# Altium schematic sheet MIXR Power - 48V Phantom Power Supply.SchDoc: Title
size B; Organization: Midnight Sun Solar Rayce Car Team; Address1: University of Waterloo; Address2: 200 University Ave W; Address3: Waterloo, ON, Canada; Address4: N2L 3E9; Website: www.uwmidsun.com; ProjectName: ProjectName
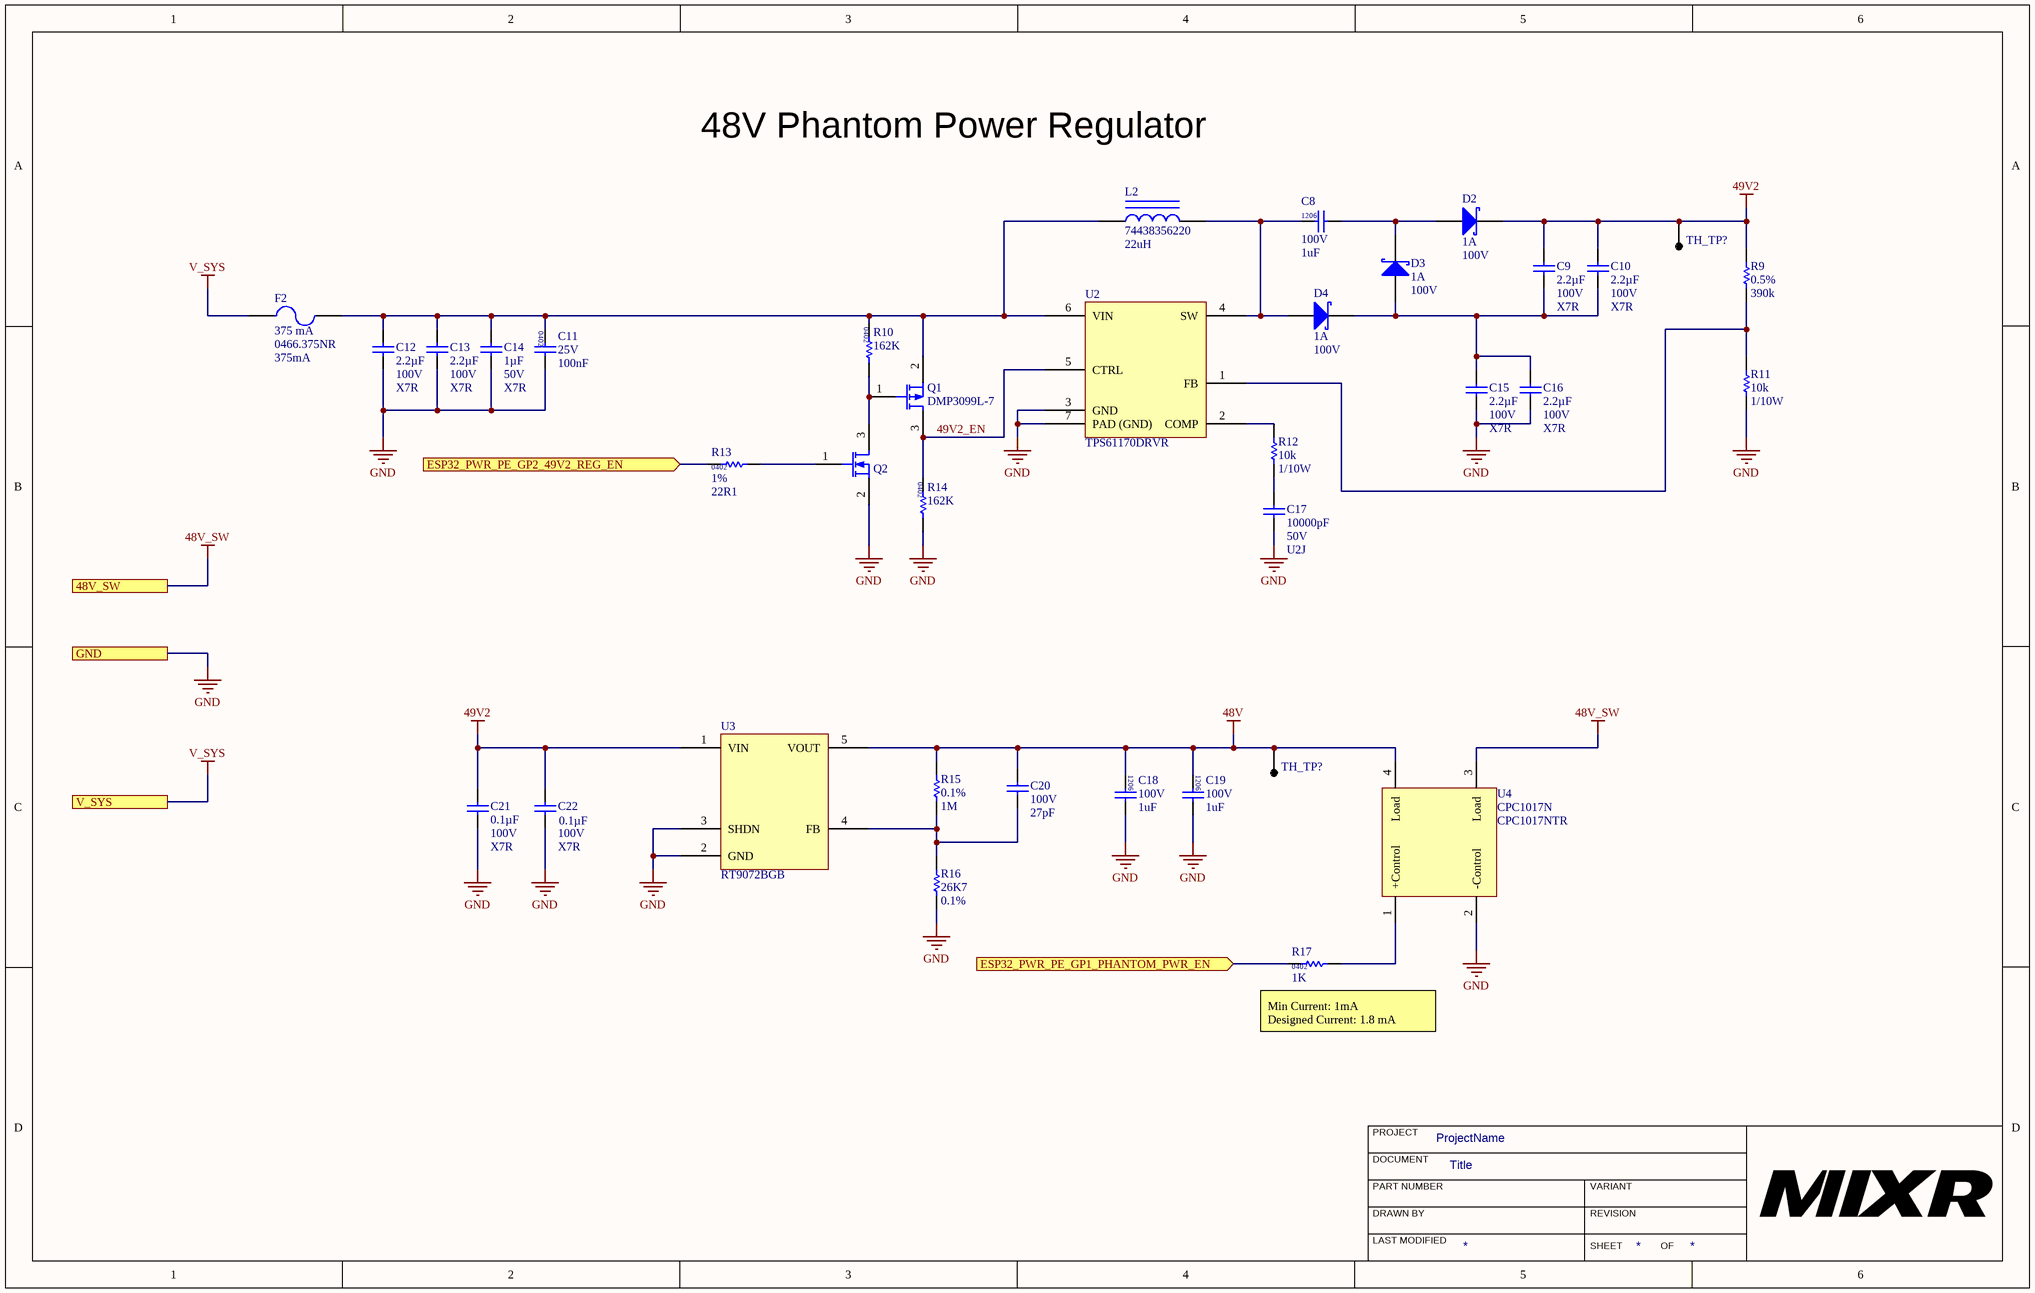
[diagram p0: MIXR Power - 48V Phantom Power Supply.SchDoc]

## Parts
(Parts that share a designator on the sheet are numbered #1, #2 ... from top to bottom, then left to right.)
C8  Voltage Rating: 100V  Capacitance: 1uF  [CAP, 1206]  (hidden comment: CAP CER 1UF 100V X7R 1206)
C9  Capacitance: 2.2µF  Voltage: 100V  Temperature Coefficient: X7R  [CAP, 1206]  (hidden comment: CAP CER 2.2UF 100V ±20% X7R 1206)
C10  Capacitance: 2.2µF  Voltage: 100V  Temperature Coefficient: X7R  [CAP, 1206]  (hidden comment: CAP CER 2.2UF 100V ±20% X7R 1206)
C11  Voltage: 25V  Capacitance: 100nF  [CAP 0402]  (hidden comment: CAP CER 0.1UF 16V X7R 0402)
C12  Capacitance: 2.2µF  Voltage: 100V  Temperature Coefficient: X7R  [CAP, 1206]  (hidden comment: CAP CER 2.2UF 100V ±20% X7R 1206)
C13  Capacitance: 2.2µF  Voltage: 100V  Temperature Coefficient: X7R  [CAP, 1206]  (hidden comment: CAP CER 2.2UF 100V ±20% X7R 1206)
C14  Capacitance: 1µF  Voltage: 50V  Temperature Coefficient: X7R  [CAP, 0603]  (hidden comment: CAP CER 1UF 50V 10% X7R 0603)
C15  Capacitance: 2.2µF  Voltage: 100V  Temperature Coefficient: X7R  [CAP, 1206]  (hidden comment: CAP CER 2.2UF 100V ±20% X7R 1206)
C16  Capacitance: 2.2µF  Voltage: 100V  Temperature Coefficient: X7R  [CAP, 1206]  (hidden comment: CAP CER 2.2UF 100V ±20% X7R 1206)
C17  Capacitance: 10000pF  Voltage: 50V  Temperature Coefficient: U2J  [CAP, 0603]  (hidden comment: CAP CER 10nF 50V 5% X7R 0603)
C18  Voltage Rating: 100V  Capacitance: 1uF  [CAP, 1206]  (hidden comment: CAP CER 1UF 100V X7R 1206)
C19  Voltage Rating: 100V  Capacitance: 1uF  [CAP, 1206]  (hidden comment: CAP CER 1UF 100V X7R 1206)
C20  Voltage Rating: 100V  Capacitance: 27pF  [CAP, 0603]  (hidden comment: CAP CER 27PF 100V 5% C0G/NP0 0603)
C21  Capacitance: 0.1µF  Voltage: 100V  Temperature Coefficient: X7R  [CAP, 0805]  (hidden comment: CAP CER 0.1UF 100V 10% X7R 0805)
C22  Capacitance: 0.1µF  Voltage: 100V  Temperature Coefficient: X7R  [CAP, 0805]  (hidden comment: CAP CER 0.1UF 100V 10% X7R 0805)
D2  Average Rectified Current: 1A  Max Reverse Voltage (DC): 100V  [DIODE SOD123]  (hidden comment: DIODE SCHOTTKY 100V 1A SOD123FL)
D3  Average Rectified Current: 1A  Max Reverse Voltage (DC): 100V  [DIODE SOD123]  (hidden comment: DIODE SCHOTTKY 100V 1A SOD123FL)
D4  Average Rectified Current: 1A  Max Reverse Voltage (DC): 100V  [DIODE SOD123]  (hidden comment: DIODE SCHOTTKY 100V 1A SOD123FL)
F2  375 mA  Manufacturer Part Number: 0466.375NR  Current Rating: 375mA  [FUSE LITTLEFUSE 0466 1206]
L2  Manufacturer Part Number: 74438356220  Inductance: 22uH  [IND 22UH 1.7A 280MOHM SMD]  (hidden comment: IND 22UH 1.7A 280 MOHM SMD)
Q1  Manufacturer Part Number: DMP3099L-7  [MOSFET P-CH 30V 3.8A SOT-23]  (hidden comment: MOSFET P-CH 30V 3.8A SOT-23)
Q2  MOSFET N-CH 30V 6.2A 0.9W SOT-23  [MOSFET N-CH 30V 6.2A 0.9W SOT-23]  (value not drawn)
R9  Tolerance: 0.5%  Resistance: 390k  [RES, 0603]  (hidden comment: RES 390K OHM 1% 1/10W 0603)
R10  Resistance: 162K  [RES 0402]  (hidden comment: RES 162K OHM 1% 1/16W 0402)
R11  Resistance: 10k  Power: 1/10W  [RES, 0603]  (hidden comment: RES 10K OHM 1% 1/10W 0603)
R12  Resistance: 10k  Power: 1/10W  [RES, 0603]  (hidden comment: RES 10K OHM 1% 1/10W 0603)
R13  Tolerance: 1%  Resistance: 22R1  [RES 0402]  (hidden comment: RES 22.1 OHM 1% 1/16W 0402)
R14  Resistance: 162K  [RES 0402]  (hidden comment: RES 162K OHM 1% 1/16W 0402)
R15  Tolerance: 0.1%  Resistance: 1M  [RES, 0603]  (hidden comment: RES 1M OHM 0.1% 1/10W 0603)
R16  Resistance: 26K7  Tolerance: 0.1%  [RES, 0603]  (hidden comment: RES 26.7K OHM 0.1% 1/10W 0603)
R17  Resistance: 1K  [RES 0402]  (hidden comment: RES 1K OHM 0.1% 1/16W 0402)
TH_TP?#1  Thru Test Point  [Thru Test Point]  (value not drawn)
TH_TP?#2  Thru Test Point  [Thru Test Point]  (value not drawn)
U2  Manufacturer Part Number: TPS61170DRVR  [QFN65P200X200X80_HS-7M]  (hidden comment: IC REG BOOST 38V 1.2A 6-WDFN)
U3  Manufacturer Part Number: RT9072BGB  [SOT95P280X145-5N]  (hidden comment: IC REG LDO 80V ADJ 20MA SOT23-5)
U4  CPC1017N  Manufacturer Part Number: CPC1017NTR  [RELAY SOP4]

## Ports
48V_SW, ESP32_PWR_PE_GP1_PHANTOM_PWR_EN (in), ESP32_PWR_PE_GP2_49V2_REG_EN (in), GND, V_SYS

## Nets
48V: C18.1 C19.1 C20.1 R15.1 TH_TP?#2.TH_TP U3.5(VOUT) U4.4(Load)
48V_SW: U4.3(Load) ; port 48V_SW
49V2: C9.1 C10.1 C21.1 C22.1 D2.1 R9.1 TH_TP?#1.TH_TP U3.1(VIN)
GND: C11.2 C12.2 C13.2 C14.2 C15.2 C16.2 C17.2 C18.2 C19.2 C21.2 C22.2 Q2.2(S) R11.2 R14.2 R16.2 U2.3(GND) U2.7(PAD_(GND)) U3.2(GND) U3.3(SHDN) U4.2(-Control) ; port GND
V_SYS: F2.1 ; port V_SYS
49V2_EN: Q1.3(D) R14.1 U2.5(CTRL)
ESP32_PWR_PE_GP1_PHANTOM_PWR_EN: R17.1 ; port ESP32_PWR_PE_GP1_PHANTOM_PWR_EN
ESP32_PWR_PE_GP2_49V2_REG_EN: R13.1 ; port ESP32_PWR_PE_GP2_49V2_REG_EN
NetC8_1: C8.1 D4.2 L2.2 U2.4(SW)
NetC8_2: C8.2 D2.2 D3.1
NetC9_2: C9.2 C10.2 C15.1 C16.1 D3.2 D4.1
NetC11_1: C11.1 C12.1 C13.1 C14.1 F2.2 L2.1 Q1.2(S) R10.1 U2.6(VIN)
NetC17_1: C17.1 R12.2
NetC20_2: C20.2 R15.2 R16.1 U3.4(FB)
NetQ1_1: Q1.1(G) Q2.3(D) R10.2
NetQ2_1: Q2.1(G) R13.2
NetR9_2: R9.2 R11.1 U2.1(FB)
NetR12_1: R12.1 U2.2(COMP)
NetR17_2: R17.2 U4.1(+Control)

## Notes on the sheet
- 48V Phantom Power Regulator
- (near R17) Min Current: 1mA
  Designed Current: 1.8 mA
- PROJECT
- DOCUMENT
- DRAWN BY
- LAST MODIFIED
- PART NUMBER
- REVISION
- SHEET
- VARIANT
- OF

## Library data of the parts
C8 C18 C19 = CAP CER 1UF 100V X7R 1206: Cap Ceramic 1uF 100V X7R 10% SMD 1206 125C Embossed T/R; Manufacturer: Samsung; Manufacturer Part Number: CL31B105KCHNNNE; Supplier 1: Digi-Key; RoHS: Yes; Category: Ceramic Capacitors; Stock 1: 981184; Pricing 1: 1=0.32000, 10=0.22100, 100=0.13260, 500=0.09942, 1000=0.08396 (USD); Mount: Surface Mount; Case Code (Metric): 3216; Case Code (Imperial): 1206; Contact Plating: Tin; Min Operating Temperature: -55°C; Max Operating Temperature: 125°C; Packaging: Tape and Reel; Tolerance: 10%; Dielectric: X7R; Length: 3.2mm; Height: 1.6mm; Width: 0.063inch; Thickness: 0.071inch; Depth: 1.6mm; Radiation Hardening: No; ComponentLink1URL: https://datasheet.ciiva.com/25711/cl31b105kchnnne-25711248.pdf?src-supplier=Digi-Key; ComponentLink1Description: https://datasheet.ciiva.com/25711/cl31b105kchnnne-25711248.pdf?src-supplier=Digi-Key; ComponentLink2URL: https://datasheet.ciiva.com/16437/clseries-16437207.pdf?src-supplier=Future+Electronics; ComponentLink2Description: https://datasheet.ciiva.com/16437/clseries-16437207.pdf?src-supplier=Future+Electronics; Case/Package: 1206; Supplier Part Number 1: 1276-1838-1-ND
C9 C10 C12 C13 C15 C16 = CAP CER 2.2UF 100V ±20% X7R 1206: 2.2µF ±20% 100V Ceramic Capacitor X7R 1206 (3216 Metric); Manufacturer 1: Murata Electronics North America; Manufacturer Part Number 1: GRM31CR72A225MA73L; Supplier 1: Digi-Key; Supplier Part Number 1: 490-12773-1-ND; Packaging: Cut Tape (CT); Part Status: Active; Operating Temperature: -55°C ~ 125°C; Ratings: -; Mounting Type: Surface Mount, MLCC; Package / Case: 1206 (3216 Metric); Size / Dimension: 0.126" L x 0.063" W (3.20mm x 1.60mm); Height - Seated (Max): -; Thickness (Max): 0.071" (1.80mm); Lead Spacing: -; Lead Style: -; ComponentLink1URL: http://www.murata.com/~/media/webrenewal/support/library/catalog/products/capacitor/mlcc/c02e.ashx; ComponentLink1Description: http://www.murata.com/~/media/webrenewal/support/library/catalog/products/capacitor/mlcc/c02e.ashx; Tolerance: ±20%
C11 = CAP CER 0.1UF 16V X7R 0402: Cap Ceramic 0.1uF 25V X7R 10% SMD 0402 125C Paper T/R; Manufacturer: Murata; Manufacturer Part Number: GRM155R71E104KE14D; Supplier 1: Digi-Key; RoHS: Yes; Category: Ceramic Capacitors; Stock 1: 785540; Pricing 1: 1=0.10000, 10=0.03400, 100=0.01520, 500=0.01088, 1000=0.00855, 2500=0.00778, 5000=0.00715 (USD); Mount: Surface Mount; Case/Package: 0402; Weight: 0.000212oz; Case Code (Metric): 1005; Case Code (Imperial): 0402; Dielectric Material: Ceramic; Min Operating Temperature: -55°C; Max Operating Temperature: 125°C; Packaging: Tape and Reel; Tolerance: 10%; Termination: SMD/SMT; Composition: Ceramic; Package Quantity: 10000; Length: 1mm; Height: 0.5mm; Width: 0.02inch; Thickness: 0.022inch; Depth: 0.5mm; REACH SVHC: Unknown; Lead Free: Lead Free; ComponentLink1URL: http://www.farnell.com/datasheets/2048008.pdf?src-supplier=Farnell; ComponentLink1Description: http://www.farnell.com/datasheets/2048008.pdf?src-supplier=Farnell; ComponentLink2URL: http://uk.rs-online.com/webdocs/144c/0900766b8144c113.pdf?src-supplier=RSComponents; ComponentLink2Description: http://uk.rs-online.com/webdocs/144c/0900766b8144c113.pdf?src-supplier=RSComponents; ComponentLink3URL: http://www.farnell.com/datasheets/1872206.pdf?src-supplier=Farnell; ComponentLink3Description: http://www.farnell.com/datasheets/1872206.pdf?src-supplier=Farnell; ComponentLink4URL: http://components.arrow.com/part/dataview/0323_06361249?src-supplier=Arrow+Europe; ComponentLink4Description: http://components.arrow.com/part/dataview/0323_06361249?src-supplier=Arrow+Europe; ComponentLink5URL: http://www.mouser.com/ds/2/281/c02e-2905.pdf?src-supplier=Mouser; ComponentLink5Description: http://www.mouser.com/ds/2/281/c02e-2905.pdf?src-supplier=Mouser; ComponentLink6URL: http://www.farnell.com/datasheets/2048008.pdf?src-supplier=Newark; ComponentLink6Description: http://www.farnell.com/datasheets/2048008.pdf?src-supplier=Newark; ComponentLink7URL: http://psearch.en.murata.com/capacitor/product/GRM155R71E104KE14%23.pdf?src-supplier=Avnet; ComponentLink7Description: http://psearch.en.murata.com/capacitor/product/GRM155R71E104KE14%23.pdf?src-supplier=Avnet; ComponentLink8URL: https://search.murata.co.jp/Ceramy/image/img/A01X/G101/ENG/GRM155R71E104KE14-01.pdf?src-supplier=Digi-Key; ComponentLink8Description: https://search.murata.co.jp/Ceramy/image/img/A01X/G101/ENG/GRM155R71E104KE14-01.pdf?src-supplier=Digi-Key; ComponentLink9URL: http://www.farnell.com/datasheets/2048008.pdf?src-supplier=Element14; ComponentLink9Description: http://www.farnell.com/datasheets/2048008.pdf?src-supplier=Element14; Supplier Part Number 1: 490-10698-1-ND; Dielectric: X7R; Voltage Rating (DC): 25V; Voltage Rating: 25V
C14 = CAP CER 1UF 50V 10% X7R 0603: 1µF ±10% 50V Ceramic Capacitor X7R 0603 (1608 Metric); Manufacturer 1: Taiyo Yuden; Manufacturer Part Number 1: UMK107AB7105KA-T; Supplier 1: Digi-Key; Supplier Part Number 1: 587-3247-1-ND; Packaging: Cut Tape (CT); Part Status: Active; Operating Temperature: -55°C ~ 125°C; Ratings: -; Mounting Type: Surface Mount, MLCC; Package / Case: 0603 (1608 Metric); Size / Dimension: 0.063" L x 0.031" W (1.60mm x 0.80mm); Height - Seated (Max): -; Thickness (Max): 0.037" (0.95mm); Lead Spacing: -; Lead Style: -; ComponentLink1URL: http://www.yuden.co.jp/productdata/catalog/en/mlcc_all_e.pdf; ComponentLink1Description: http://www.yuden.co.jp/productdata/catalog/en/mlcc_all_e.pdf; Tolerance: ±10%
C17 = CAP CER 10nF 50V 5% X7R 0603: 10000pF ±5% 50V Ceramic Capacitor U2J 0603 (1608 Metric); Manufacturer 1: KEMET; Manufacturer Part Number 1: C0603C103J5JAC7867; Supplier 1: Digi-Key; Supplier Part Number 1: 399-13384-1-ND; Packaging: Cut Tape (CT); Part Status: Active; Operating Temperature: -55°C ~ 125°C; Ratings: -; Failure Rate: -; Mounting Type: Surface Mount, MLCC; Package / Case: 0603 (1608 Metric); Size / Dimension: 0.063" L x 0.032" W (1.60mm x 0.80mm); Height - Seated (Max): -; Thickness (Max): 0.034" (0.87mm); Lead Spacing: -; Lead Style: -; ComponentLink1URL: http://www.kemet.com/docfinder?Partnumber=C0603C103J5JAC7867; ComponentLink1Description: http://www.kemet.com/docfinder?Partnumber=C0603C103J5JAC7867; Tolerance: ±5%
C20 = CAP CER 27PF 100V 5% C0G/NP0 0603: Cap Ceramic 27pF 100V C0G 5% SMD 0603 125C Paper T/R; Manufacturer: Yageo; Manufacturer Part Number: CC0603JRNPO0BN270; Insulation Resistance: 10GR; Supplier 1: Digi-Key; RoHS: Yes; Category: Ceramic Capacitors; Stock 1: 38025; Pricing 1: 1=0.10000, 10=0.06400, 100=0.02870, 500=0.02048, 1000=0.01609 (USD); Mount: Surface Mount; Case/Package: 0603; Weight: 7.1E-05oz; Case Code (Imperial): 0603; Case Code (Metric): 1608; Min Operating Temperature: -55°C; Max Operating Temperature: 125°C; Packaging: Tape and Reel; Tolerance: 5%; Voltage Rating (DC): 100V; Termination: SMD/SMT; Composition: Ceramic; Length: 0.063inch; Width: 0.031inch; Thickness: 0.035inch; Depth: 0.8mm; Lead Free: Lead Free; ComponentLink1URL: http://www.mouser.com/ds/2/447/Yageo_UPY-GP_NP0_16V-to-50V_9-358835.pdf?src-supplier=Mouser; ComponentLink1Description: http://www.mouser.com/ds/2/447/Yageo_UPY-GP_NP0_16V-to-50V_9-358835.pdf?src-supplier=Mouser; ComponentLink2URL: http://components.arrow.com/part/dataview/0323_00784682?src-supplier=Arrow+Europe; ComponentLink2Description: http://components.arrow.com/part/dataview/0323_00784682?src-supplier=Arrow+Europe; ComponentLink3URL: http://www.yageo.com/documents/recent/UPY-NP0X7R_MV_100-to-630V_21.pdf?src-supplier=Digi-Key; ComponentLink3Description: http://www.yageo.com/documents/recent/UPY-NP0X7R_MV_100-to-630V_21.pdf?src-supplier=Digi-Key; ComponentLink4URL: http://www.yageo.com/documents/recent/UPY-GP_NP0_16V-to-50V_16.pdf?src-supplier=Future+Electronics; ComponentLink4Description: http://www.yageo.com/documents/recent/UPY-GP_NP0_16V-to-50V_16.pdf?src-supplier=Future+Electronics; Dielectric: C0G; Supplier Part Number 1: 311-1757-1-ND
C21 C22 = CAP CER 0.1UF 100V 10% X7R 0805: 0.1µF ±10% 100V Ceramic Capacitor X7R 0805 (2012 Metric); Manufacturer 1: Murata Electronics North America; Manufacturer Part Number 1: GCM21BR72A104KA37L; Supplier 1: Digi-Key; Supplier Part Number 1: 490-4789-1-ND; Packaging: Cut Tape (CT); Part Status: Active; Operating Temperature: -55°C ~ 125°C; Ratings: AEC-Q200; Mounting Type: Surface Mount, MLCC; Package / Case: 0805 (2012 Metric); Size / Dimension: 0.079" L x 0.049" W (2.00mm x 1.25mm); Height - Seated (Max): -; Thickness (Max): 0.055" (1.40mm); Lead Spacing: -; Lead Style: -; ComponentLink1URL: http://www.murata.com/~/media/webrenewal/support/library/catalog/products/capacitor/mlcc/c03e.ashx; ComponentLink1Description: http://www.murata.com/~/media/webrenewal/support/library/catalog/products/capacitor/mlcc/c03e.ashx; Tolerance: ±10%
D2-D4 = DIODE SCHOTTKY 100V 1A SOD123FL: Manufacturer: MCC; Manufacturer Part Number: SL110PL-TP; Supplier 1: Digi-Key; RoHS: Yes; Category: Rectifier Diodes; Stock 1: 10587; Pricing 1: 1=0.33000, 10=0.24700, 100=0.11740, 500=0.09580, 1000=0.07107 (USD); Mount: Surface Mount; Packaging: Tape and Reel; ComponentLink1URL: http://www.mccsemi.com/up_pdf/SL14PL-SL110PL(SOD-123FL)-A.pdf?src-supplier=Digi-Key; ComponentLink1Description: http://www.mccsemi.com/up_pdf/SL14PL-SL110PL(SOD-123FL)-A.pdf?src-supplier=Digi-Key; Supplier Part Number 1: SL110PL-TPMSCT-ND
F2 = FUSE 375MA 125VDC 1206: FUSE BOARD MNT 375MA 125VAC/VDC; Manufacturer: Littelfuse; Body Material: Thermoplastic; Voltage Rating (DC): 125V; Resistance: 690mR; DC Cold Resistance: 350mR; Fuse Type: Board Mount (Cartridge Style Excluded); Approvals: CSA,UL; Supplier 1: Digi-Key; Stock 1: 22359; Pricing 1: 1=0.84, 5=0.812, 10=0.787, 50=0.6618, 100=0.5493, 250=0.4994, 500=0.4245, 1000=0.37455 (USD); Mount: Surface Mount; Case/Package: 1206; Number of Pins: 2; Case Code (Metric): 3216; Case Code (Imperial): 1206; Housing Material: Ceramic; Terminal Material: Copper; Min Operating Temperature: -55°C; Max Operating Temperature: 90°C; Packaging: Tape and Reel; Package Quantity: 5000; Voltage Rating: 125V; Termination: SMD/SMT; Voltage Rating (AC): 125V; Fuse Current: 375mA; Working Voltage: 125V; Length: 3.18mm; Height: 0.023inch; Width: 0.06inch; Depth: 1.52mm; Radiation Hardening: No; REACH SVHC: Unknown; Lead Free: Lead Free; ComponentLink1URL: http://www.littelfuse.com/data/en/Data_Sheets/Littelfuse_Fuse_466.pdf; ComponentLink1Description: http://www.littelfuse.com/data/en/Data_Sheets/Littelfuse_Fuse_466.pdf; ComponentLink2URL: http://www.littelfuse.com/~/media/electronics/datasheets/fuses/littelfuse_fuse_466_datasheet.pdf.pdf; ComponentLink2Description: http://www.littelfuse.com/~/media/electronics/datasheets/fuses/littelfuse_fuse_466_datasheet.pdf.pdf; ComponentLink3URL: //media.digikey.com/pdf/Data%20Sheets/Littelfuse%20PDFs/466%20Series%20Drawing.pdf; ComponentLink3Description: //media.digikey.com/pdf/Data%20Sheets/Littelfuse%20PDFs/466%20Series%20Drawing.pdf; ComponentLink4URL: http://www.farnell.com/datasheets/48294.pdf; ComponentLink4Description: http://www.farnell.com/datasheets/48294.pdf; ComponentLink5URL: https://www.verical.com/server-webapp/html/getDatasheet?partID=134212; ComponentLink5Description: https://www.verical.com/server-webapp/html/getDatasheet?partID=134212; Supplier Part Number 1: F1453CT-ND
L2 = IND 22UH 1.7A 280 MOHM SMD: FIXED IND 22UH 1.7A 280MOHM SMD; Manufacturer: Wurth Electronics; Supplier 1: Digi-Key; RoHS: No; Stock 1: 1274; Pricing 1: 1=1.99000, 50=1.89700, 100=1.75600, 250=1.62600, 500=1.50600 (USD); ComponentLink1URL: https://katalog.we-online.de/pbs/datasheet/74438356220.pdf?src-supplier=Digi-Key; ComponentLink1Description: https://katalog.we-online.de/pbs/datasheet/74438356220.pdf?src-supplier=Digi-Key; Supplier Part Number 1: 732-11664-1-ND
Q1 = MOSFET P-CH 30V 3.8A SOT-23: P-Channel 30V 3.8A (Ta) 1.08W (Ta) Surface Mount SOT-23; Manufacturer: Diodes Incorporated; Drive Voltage (Max Rds On,  Min Rds On): 4.5V, 10V; Rds On (Max) @ Id, Vgs: 65 mOhm @ 3.8A, 10V; Vgs(th) (Max) @ Id: 2.1V @ 250µA; Vgs (Max): ±20V; Supplier 1: Digi-Key; RoHS: RoHS Compliant; Category: Discrete Semiconductor Products; Stock 1: 108364; Pricing 1: 1=0.59, 10=0.429, 100=0.2522, 500=0.14282, 1000=0.10949 (CAD); Packaging: Cut Tape (CT); Part Status: Active; FET Type: P-Channel; Technology: MOSFET (Metal Oxide); Current - Continuous Drain (Id) @ 25°C: 3.8A (Ta); FET Feature: -; Power Dissipation (Max): 1.08W (Ta); Operating Temperature: -55°C ~ 150°C (TJ); Mounting Type: Surface Mount; Supplier Device Package: SOT-23; Package / Case: TO-236-3, SC-59, SOT-23-3; ComponentLink1URL: https://www.diodes.com/assets/Datasheets/DMP3099L.pdf; ComponentLink1Description: https://www.diodes.com/assets/Datasheets/DMP3099L.pdf; Supplier Part Number 1: DMP3099L-7DICT-ND
Q2 = MOSFET N-CH 30V 6.2A 0.9W SOT-23: N-Channel 30V 6.2A (Ta) 900mW (Ta) Surface Mount SOT-23; Manufacturer: Diodes; Manufacturer Part Number: DMN3023L-7; Rds On Max: 25mR; Input Capacitance: 873pF; Supplier 1: Digi-Key; Stock 1: 38246; Pricing 1: 1=0.47, 10=0.368, 100=0.2529, 500=0.1734, 1000=0.1301 (USD); Mount: Surface Mount; Case/Package: TO-236-3; Min Operating Temperature: -55°C; Max Operating Temperature: 150°C; Packaging: Tape and Reel; Drain to Source Voltage (Vdss): 30V; Continuous Drain Current (ID): 6.2A; Max Power Dissipation: 900mW; ComponentLink1URL: https://www.diodes.com/assets/Datasheets/DMN3023L.pdf; ComponentLink1Description: https://www.diodes.com/assets/Datasheets/DMN3023L.pdf; ComponentLink2URL: http://www.mouser.com/ds/2/115/DMN3023L-959533.pdf; ComponentLink2Description: http://www.mouser.com/ds/2/115/DMN3023L-959533.pdf; Supplier Part Number 1: DMN3023L-7DICT-ND
R9 = RES 390K OHM 1% 1/10W 0603: 390 kOhms ±0.5% 0.1W, 1/10W Chip Resistor 0603 (1608 Metric) Thin Film /; Manufacturer: Yageo; Manufacturer Part Number: RT0603DRE07390KL; Max Power Dissipation: 100mW; Temperature Coefficient: 50ppm/°C; Supplier 1: Digi-Key; Supplier Part Number 1: 311-2555-1-ND; Stock 1: 4470; Pricing 1: 1 = 0.13000, 10 = 0.11900, 100 = 0.04580, 1000 = 0.02014, 2500 = 0.01740 (USD); RoHS: Yes; Case/Package: 0603; Case Code (Metric): 1608; Case Code (Imperial): 0603; Min Operating Temperature: -55°C; Max Operating Temperature: 155°C; Packaging: Tape and Reel; Composition: Thin Film; Number of Terminations: 2; Features: Moisture Resistant; Length: 0.063inch; Height: 0.022inch; Width: 0.031inch; ComponentLink1URL: http://www.yageo.com/documents/recent/PYu-RT_1-to-0.01_RoHS_L_9.pdf?src-supplier=Digi-Key; ComponentLink1Description: http://www.yageo.com/documents/recent/PYu-RT_1-to-0.01_RoHS_L_9.pdf?src-supplier=Digi-Key
R10 R14 = RES 162K OHM 1% 1/16W 0402: RES SMD 162K OHM 1% 1/16W 0402; Manufacturer: Yageo; Manufacturer Part Number: RC0402FR-07162KL; Temperature Coefficient: 100ppm/°C; Voltage Rating: 50V; Power Rating: 62.5mW; Max Power Dissipation: 63mW; Supplier 1: Digi-Key; Supplier Part Number 1: YAG2370CT-ND; Packaging: Tape and Reel; Composition: Thick Film; ComponentLink1URL: https://datasheet.ciiva.com/2452/pyu-r-int-thick-7-2452605.pdf?src-supplier=Digi-Key; ComponentLink1Description: https://datasheet.ciiva.com/2452/pyu-r-int-thick-7-2452605.pdf?src-supplier=Digi-Key; Tolerance: 1%; RoHS: Yes; Category: Chip SMD Resistors; Stock 1: 987661; Pricing 1: 1=0.10000, 10=0.01600, 100=0.00640, 1000=0.00289, 2500=0.00251, 5000=0.00207 (USD); Case/Package: 0402; Case Code (Imperial): 0402; Case Code (Metric): 1005; Min Operating Temperature: -55°C; Max Operating Temperature: 155°C; Voltage Rating (DC): 50V; Termination: SMD/SMT; Military Standard: Not; Number of Terminations: 2; Length: 1mm; Height: 0.016inch; Width: 0.02inch; Depth: 0.5mm; Lead Free: Lead Free; ComponentLink2URL: https://datasheet.ciiva.com/16869/pyu-rc0402-51-rohs-l-6-16869191.pdf?src-supplier=Avnet+Europe; ComponentLink2Description: https://datasheet.ciiva.com/16869/pyu-rc0402-51-rohs-l-6-16869191.pdf?src-supplier=Avnet+Europe; Contact Plating: Tin,Matte; Package Quantity: 10000; Features: Moisture Resistant
R11 R12 = RES 10K OHM 1% 1/10W 0603: RES SMD 10K OHM 1% 1/10W 0603; Manufacturer 1: Yageo; Manufacturer Part Number 1: RC0603FR-0710KL; Temperature Coefficient: ±100ppm/°C; Supplier 1: Digi-Key; Supplier Part Number 1: 311-10.0KHRCT-ND; Packaging: Cut Tape (CT); Part Status: Active; Composition: Thick Film; Operating Temperature: -55°C ~ 155°C; Package / Case: 0603 (1608 Metric); Supplier Device Package: 0603; Size / Dimension: 0.063" L x 0.031" W (1.60mm x 0.80mm); Height - Seated (Max): 0.022" (0.55mm); Failure Rate: -; ComponentLink1URL: http://www.yageo.com/documents/recent/PYu-RC_Group_51_RoHS_L_7.pdf; ComponentLink1Description: http://www.yageo.com/documents/recent/PYu-RC_Group_51_RoHS_L_7.pdf; Tolerance: ±1%
R13 = RES 22.1 OHM 1% 1/16W 0402: RES SMD 22.1 OHM 1% 1/16W 0402; Manufacturer: Yageo; Manufacturer Part Number: RC0402FR-0722R1L; Power Rating: 62.5mW; Voltage Rating: 50V; Temperature Coefficient: 100ppm/°C; Max Power Dissipation: 63mW; Supplier 1: Digi-Key; RoHS: Yes; Category: Chip SMD Resistors; Stock 1: 5073010; Pricing 1: 1=0.10000, 10=0.01600, 100=0.00640, 1000=0.00289, 2500=0.00251, 5000=0.00207 (USD); Case/Package: 0402; Case Code (Imperial): 0402; Case Code (Metric): 1005; Min Operating Temperature: -55°C; Max Operating Temperature: 155°C; Packaging: Tape and Reel; Package Quantity: 1; Termination: SMD/SMT; Composition: Thick Film; Number of Terminations: 2; Military Standard: Not; Features: Moisture Resistant; Voltage Rating (DC): 50V; Working Voltage: 50V; Length: 1mm; Height: 0.016inch; Width: 0.02inch; Depth: 0.5mm; Lead Free: Lead Free; REACH SVHC: No SVHC; ComponentLink1URL: https://datasheet.ciiva.com/11808/0900766b80c66297-11808453.pdf?src-supplier=RSComponents; ComponentLink1Description: https://datasheet.ciiva.com/11808/0900766b80c66297-11808453.pdf?src-supplier=RSComponents; ComponentLink2URL: https://datasheet.ciiva.com/16740/pyu-rc0402-51-rohs-l-6-r-16740855.pdf?src-supplier=Future+Electronics; ComponentLink2Description: https://datasheet.ciiva.com/16740/pyu-rc0402-51-rohs-l-6-r-16740855.pdf?src-supplier=Future+Electronics; ComponentLink3URL: https://datasheet.ciiva.com/2518/pyu-r-int-thick-7-2518970.pdf?src-supplier=Digi-Key; ComponentLink3Description: https://datasheet.ciiva.com/2518/pyu-r-int-thick-7-2518970.pdf?src-supplier=Digi-Key; ComponentLink4URL: https://datasheet.ciiva.com/2518/pyu-r-int-thick-7-2518971.pdf?src-supplier=Digi-Key; ComponentLink4Description: https://datasheet.ciiva.com/2518/pyu-r-int-thick-7-2518971.pdf?src-supplier=Digi-Key; ComponentLink5URL: https://datasheet.ciiva.com/2518/pyu-r-int-thick-7-2518972.pdf?src-supplier=Digi-Key; ComponentLink5Description: https://datasheet.ciiva.com/2518/pyu-r-int-thick-7-2518972.pdf?src-supplier=Digi-Key; Supplier Part Number 1: 311-22.1LRCT-ND
R15 = RES 1M OHM 0.1% 1/10W 0603: RES SMD 1M OHM 0.1% 1/10W 0603; Manufacturer: Yageo; Manufacturer Part Number: RT0603BRD071ML; Max Power Dissipation: 100mW; Temperature Coefficient: 25ppm/°C; Supplier 1: Digi-Key; RoHS: Yes; Category: Chip SMD Resistors; Stock 1: 26042; Pricing 1: 1=0.35000, 10=0.29600, 100=0.11550, 1000=0.04837, 2500=0.04434 (USD); Case/Package: 0603; Min Operating Temperature: -55°C; Max Operating Temperature: 155°C; Packaging: Tape and Reel; Composition: Thin Film; Number of Terminations: 2; Features: Moisture Resistant; Length: 0.063inch; Height: 0.022inch; Width: 0.031inch; ComponentLink1URL: http://www.yageo.com/documents/recent/PYu-RT_1-to-0.01_RoHS_L_9.pdf?src-supplier=Digi-Key; ComponentLink1Description: http://www.yageo.com/documents/recent/PYu-RT_1-to-0.01_RoHS_L_9.pdf?src-supplier=Digi-Key; Supplier Part Number 1: YAG4498CT-ND
R16 = RES 26.7K OHM 0.1% 1/10W 0603: RES SMD 26.7K OHM 0.1% 1/5W 0603; Manufacturer: Panasonic; Manufacturer Part Number: ERJ-PB3B2672V; Max Power Dissipation: 200mW; Temperature Coefficient: 50ppm/°C; Supplier 1: Digi-Key; RoHS: Yes; Category: Chip SMD Resistors; Stock 1: 4400; Pricing 1: 1=0.25000, 10=0.21100, 25=0.15320, 50=0.11100, 100=0.08230, 250=0.06316, 500=0.04976, 1000=0.03445 (USD); Case/Package: 0603; Case Code (Metric): 1608; Case Code (Imperial): 0603; Min Operating Temperature: -55°C; Max Operating Temperature: 155°C; Packaging: Tape and Reel; Composition: Thick Film; Number of Terminations: 2; Features: Automotive AEC-Q200; Length: 0.063inch; Width: 0.032inch; Height - Seated (Max): 0.022inch; ComponentLink1URL: https://industrial.panasonic.com/sa/system/files/data/download/catalog/id_fixed-resistors_e_2.pdf?src-supplier=Digi-Key; ComponentLink1Description: https://industrial.panasonic.com/sa/system/files/data/download/catalog/id_fixed-resistors_e_2.pdf?src-supplier=Digi-Key; Supplier Part Number 1: P20132CT-ND
R17 = RES 1K OHM 0.1% 1/16W 0402: RES SMD 1K OHM 0.1% 1/16W 0402; Manufacturer: Yageo; Manufacturer Part Number: RT0402BRE071KL; Temperature Coefficient: 50ppm/°C; Power Rating: 62.5mW; Voltage Rating: 50V; Max Power Dissipation: 63mW; Supplier 1: Digi-Key; Supplier Part Number 1: YAG2306CT-ND; RoHS: Yes; Category: Chip SMD Resistors; Stock 1: 46127; Pricing 1: 1=0.41000, 10=0.29200, 100=0.11690, 1000=0.05758, 2500=0.05335, 5000=0.04827 (USD); Packaging: Tape and Reel; Tolerance: 0.1%; Composition: Thin Film; Features: Moisture Resistant; ComponentLink1URL: https://datasheet.ciiva.com/2582/pyu-rt-1-to-0-05-rohs-l-5-2582672.pdf?src-supplier=Digi-Key; ComponentLink1Description: https://datasheet.ciiva.com/2582/pyu-rt-1-to-0-05-rohs-l-5-2582672.pdf?src-supplier=Digi-Key; Case/Package: 0402; Weight: 2.3E-05oz; Case Code (Metric): 1005; Case Code (Imperial): 0402; Min Operating Temperature: -55°C; Max Operating Temperature: 125°C; Package Quantity: 10000; Number of Terminations: 2; Termination: SMD/SMT; Military Standard: Not; Voltage Rating (DC): 50V; Length: 1mm; Height: 0.014inch; Width: 0.02inch; Depth: 0.5mm; Lead Free: Lead Free; ComponentLink2URL: https://datasheet.ciiva.com/12796/pyu-rt-1-to-0-05-rohs-l-4-12796476.pdf?src-supplier=Mouser; ComponentLink2Description: https://datasheet.ciiva.com/12796/pyu-rt-1-to-0-05-rohs-l-4-12796476.pdf?src-supplier=Mouser
U2 = IC REG BOOST 38V 1.2A 6-WDFN: Boost, Buck-Boost, Flyback, SEPIC Switching Regulator IC Positive Adjustable 3V 1 Output 960mA (Switch) 6-WDFN Exposed Pad; Manufacturer: Texas Instruments; Switching Frequency: 1.2MHz; Number of Outputs: 1; Efficiency: 93%; Max Input Voltage: 18V; Synchronous Rectifier: No; Quiescent Current: 2.3mA; Nominal Supply Current: 2.2mA; Supplier 1: Digi-Key; RoHS: Yes; Category: Voltage Regulators - Switching; Stock 1: 61005; Pricing 1: 1=2.14000, 10=1.92200, 25=1.81280, 100=1.45020, 250=1.26896, 500=1.23270, 1000=0.97891 (USD); Case/Package: QFN; Number of Pins: 6; Min Operating Temperature: -40°C; Max Operating Temperature: 85°C; Output Current: 1.2A; Output Voltage: 38V; Package Quantity: 1; Packaging: Tape and Reel; Max Output Current: 960mA; Min Input Voltage: 3V; Min Output Voltage: 3V; Max Output Voltage: 38V; Topology: Boost; Operating Supply Voltage: 18V; Output Type: Adjustable; Output Configuration: Positive; Radiation Hardening: No; REACH SVHC: No SVHC; Lead Free: Lead Free; ComponentLink1URL: https://datasheet.ciiva.com/7115/1764435-7115937.pdf?src-supplier=Newark; ComponentLink1Description: https://datasheet.ciiva.com/7115/1764435-7115937.pdf?src-supplier=Newark; ComponentLink2URL: https://datasheet.ciiva.com/41462/001014890-da-01-en-ic-reg-multi-con-tps61170drvr-wson-6-tid-41462735.pdf?src-supplier=Conrad; ComponentLink2Description: https://datasheet.ciiva.com/41462/001014890-da-01-en-ic-reg-multi-con-tps61170drvr-wson-6-tid-41462735.pdf?src-supplier=Conrad; ComponentLink3URL: https://datasheet.ciiva.com/2025/tps61170-2025720.pdf?src-supplier=Digi-Key; ComponentLink3Description: https://datasheet.ciiva.com/2025/tps61170-2025720.pdf?src-supplier=Digi-Key; ComponentLink4URL: https://datasheet.ciiva.com/2025/tps61170-2025721.pdf?src-supplier=Digi-Key; ComponentLink4Description: https://datasheet.ciiva.com/2025/tps61170-2025721.pdf?src-supplier=Digi-Key; ComponentLink5URL: https://datasheet.ciiva.com/15223/getdatasheetpartid-294050-15223093.pdf?src-supplier=Verical; ComponentLink5Description: https://datasheet.ciiva.com/15223/getdatasheetpartid-294050-15223093.pdf?src-supplier=Verical; ComponentLink6URL: https://datasheet.ciiva.com/2025/tps61170-2025719.pdf?src-supplier=Digi-Key; ComponentLink6Description: https://datasheet.ciiva.com/2025/tps61170-2025719.pdf?src-supplier=Digi-Key; Supplier Part Number 1: 296-22945-1-ND
U3 = IC REG LDO 80V ADJ 20MA SOT23-5: Linear Voltage Regulator IC 1 Output 20mA SOT-23-5; Manufacturer: Richtek; Supplier 1: Digi-Key; RoHS: No; Stock 1: 495; Pricing 1: 1=1.34000, 10=1.19700, 25=1.13640, 100=0.87250, 250=0.77104, 500=0.73048, 1000=0.56815 (USD); ComponentLink1URL: http://www.richtek.com/assets/product_file/RT9072A=RT9072B/DS9072AB-01.pdf?src-supplier=Digi-Key; ComponentLink1Description: http://www.richtek.com/assets/product_file/RT9072A=RT9072B/DS9072AB-01.pdf?src-supplier=Digi-Key; ComponentLink2URL: https://www.richtek.com/assets/product_file/RT9072A=RT9072B/DS9072AB-01.pdf?src-supplier=Digi-Key; ComponentLink2Description: https://www.richtek.com/assets/product_file/RT9072A=RT9072B/DS9072AB-01.pdf?src-supplier=Digi-Key; Supplier Part Number 1: RT9072BGBCT-ND
U4 = RELAY SOLID STATE CPC1017N SPST 100mA: Relay Solid-State SPST-NO 4-SOP; Manufacturer: IXYS Integrated Circuits Division; Circuit: SPST-NO (1 Form A); Output Type: AC, DC; On-State Resistance (Max): 16 Ohm; Voltage - Input: 1.2VDC; Voltage - Load: 0 ~ 60 V; Supplier 1: Digi-Key; RoHS: RoHS Compliant; Category: Relays; Stock 1: 86929; Pricing 1: 1=1.76, 10=1.561, 25=1.41, 100=1.2334, 250=1.0824, 500=0.95658, 1000=0.75519 (CAD); Packaging: Cut Tape (CT); Part Status: Active; Mounting Type: Surface Mount; Termination Style: Gull Wing; Package / Case: 4-SOP (0.150", 3.81mm); Supplier Device Package: 4-SOP (2.54mm); Relay Type: Relay; ComponentLink1URL: http://www.ixysic.com/home/pdfs.nsf/www/CPC1017N.pdf/$file/CPC1017N.pdf; ComponentLink1Description: http://www.ixysic.com/home/pdfs.nsf/www/CPC1017N.pdf/$file/CPC1017N.pdf; Supplier Part Number 1: CLA233CT-ND